# EAGLE design BasicLEDBadge (EAGLE 7.6.0)
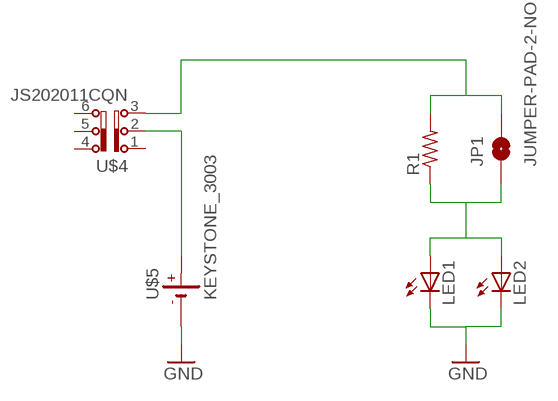
[diagram p0: schematic, sheet 1]

## Parts
JP1  JUMPER-PAD-2-NO  [PAD-JUMPER-2-NO_NO_SILK]
LED1  LED5MM  [LED5MM]
LED2  LED5MM  [LED5MM]
R1  R-US_0207/9  [0207/9]
U$4  JS202011CQN  [JS202011CQN]
U$5  KEYSTONE_3003  [KEYSTONE_3003]

## Nets
GND: LED1.K(C) LED2.K(C) U$5.P$3(-)
SW_BATT: JP1.2 R1.2 U$4.3
VBATT: U$4.2 U$5.P$1(+) U$5.P$2(+)
VLED: JP1.1 LED1.A LED2.A R1.1
Unconnected: U$4.1 U$4.4 U$4.5 U$4.6

## Library data of the parts
JP1 = SparkFun-Passives:JUMPER-PAD-2-NO
LED1 LED2 = adafruit:LED: LED OSRAM: - CHIPLED LG R971, LG N971, LY N971, LG Q971, LY Q971, LO R971, LY R971 LH N974, LH R974 LS Q976, LO Q976, LY Q976 LO Q996 - Hyper CHIPLED LW Q18S LB Q993, LB Q99A, LB R99A - SideLED LS A670, LO A670, LY A670, LG A670, LP A670 LB A673, LV A673, LT A673, LW A673 LH A674 LY A675 LS A676, LA A676, LO A676, LY A676, LW A676 LS A679, LY A679, LG A679 - Hyper Micro SIDELED® LS Y876, LA Y876, LO Y876, LY Y876 LT Y87S - SmartLED LW L88C, LW L88S LB L89C, LB L89S, LG L890 LS L89K, LO L89K, LY L89K LS L896, LA L896, LO L896, LY L896 - TOPLED LS T670, LO T670, LY T670, LG T670, LP T670 LSG T670, LSP T670, LSY T670, LOP T670, LYG T670 LG T671, LOG T671, LSG T671 LB T673, LV T673, LT T673, LW T673 LH T674 LS T676, LA T676, LO T676, LY T676, LB T676, LH T676, LSB T676, LW T676 LB T67C, LV T67C, LT T67C, LS T67K, LO T67K, LY T67K, LW E67C LS E67B, LA E67B, LO E67B, LY E67B, LB E67C, LV E67C, LT E67C LW T67C LS T679, LY T679, LG T679 LS T770, LO T770, LY T770, LG T770, LP T770 LB T773, LV T773, LT T773, LW T773 LH T774 LS E675, LA E675, LY E675, LS T675 LS T776, LA T776, LO T776, LY T776, LB T776 LHGB T686 LT T68C, LB T68C - Hyper Mini TOPLED® LB M676 - Mini TOPLED Santana® LG M470 LS M47K, LO M47K, LY M47K Source: http://www.osram.convergy.de/
R1 = adafruit:R-US_: RESISTOR, American symbol
U$4 = switch:JS202011CQN: DPDT through hole slide switch
U$5 = battery:KEYSTONE_3003: Keystone 3003 20mm coin cell battery clip

## Board
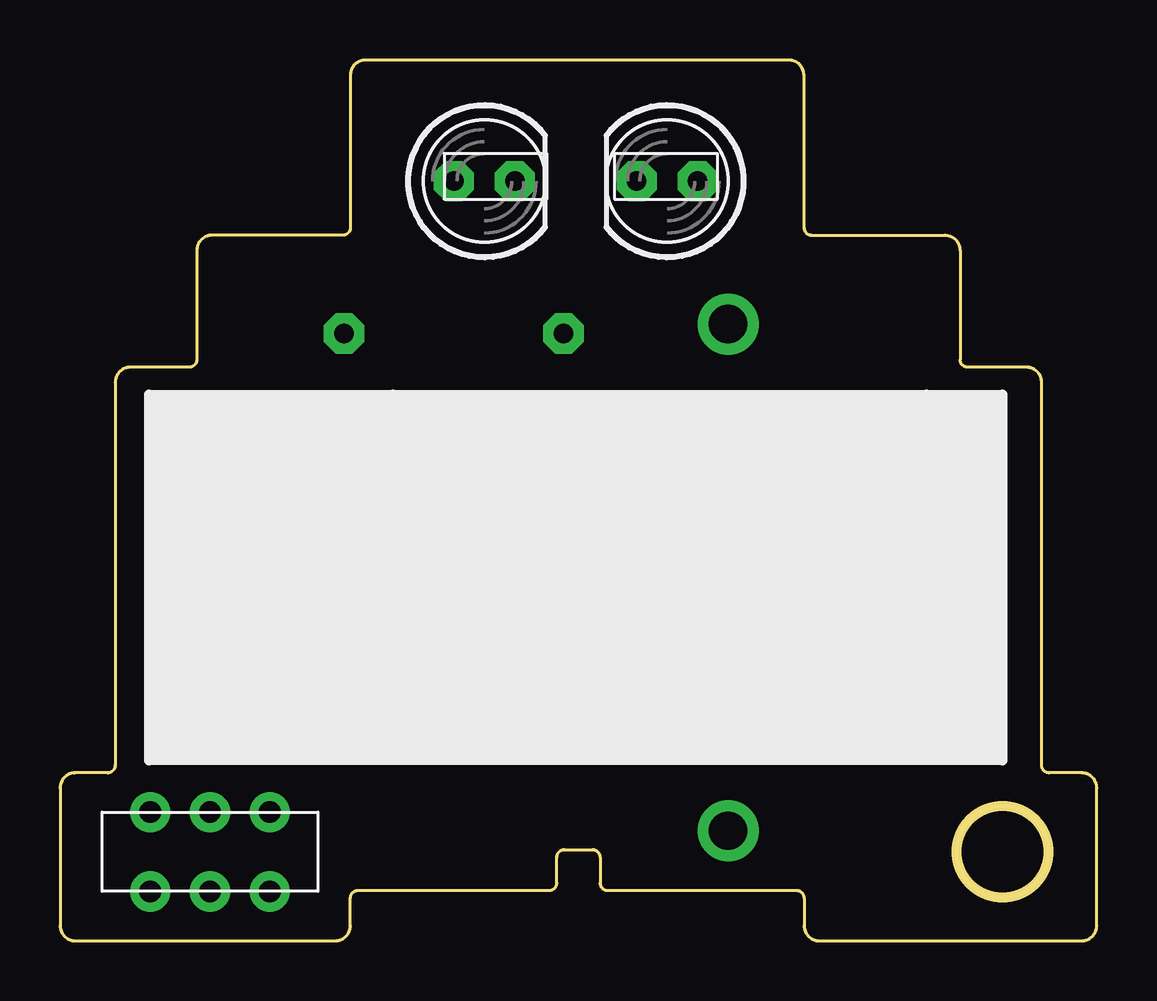
[diagram p1: board, top side]
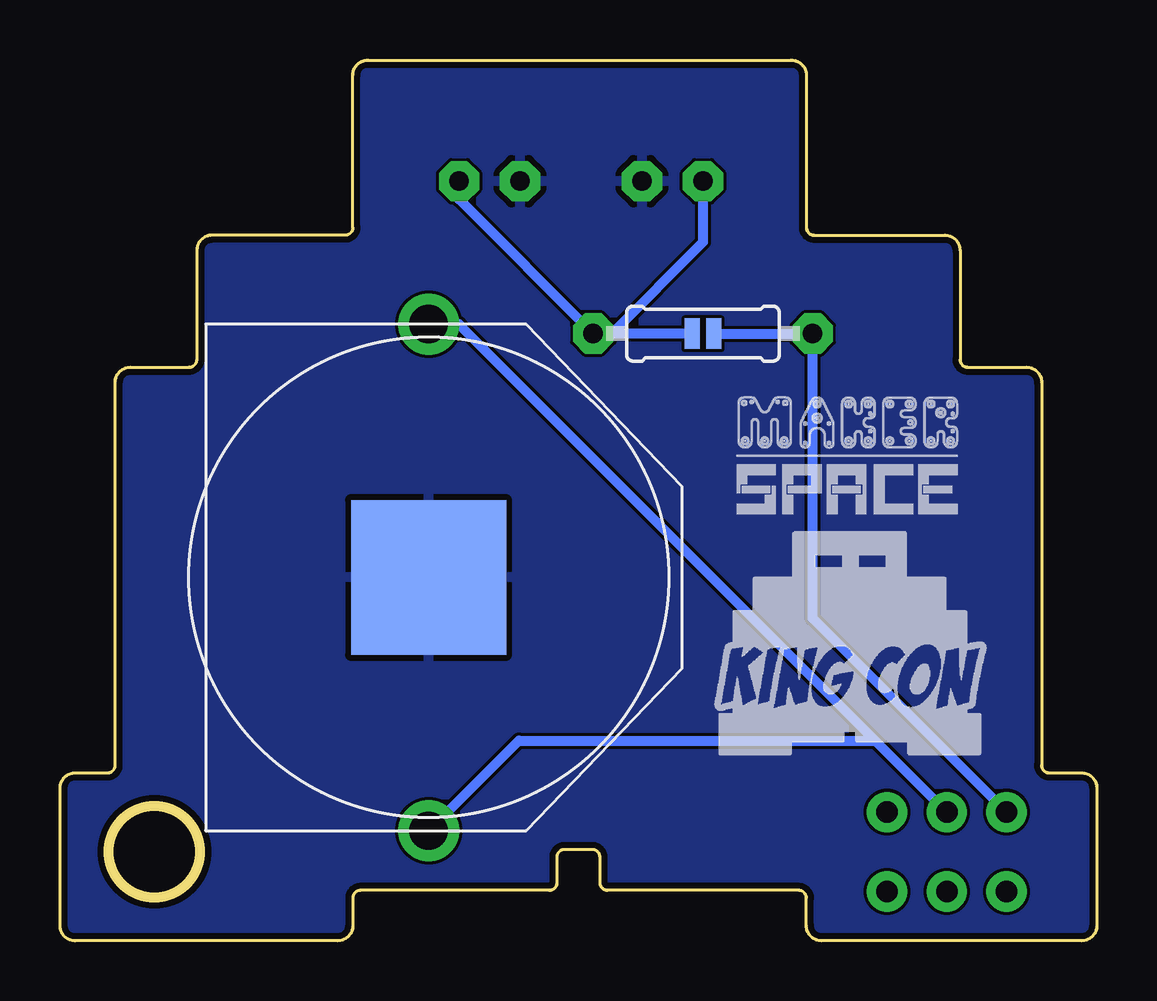
[diagram p2: board, bottom side, seen from below]

Size 43.2 x 36.7 mm. Coordinates in mm from the lower left corner, seen from the top.
Outline: circle at 39.27,3.71 radius 1.91
Copper layers (1*16): Top 0.035mm / dielectric 1.5mm / Bottom 0.035mm
Design rules "dirt_cheap_dirty_boards.v1": minimum track width 5mil, minimum drill 12mil, track to track 5mil, track to pad 5mil, pad to pad 5mil, via to via 5mil, smd to smd 0mil, copper to edge 10mil, drill to drill 10mil, minimum pad ring 10mil, minimum via ring 6mil, stop-mask expansion 2mil, vias tented up to drill 25mil, thermal gap 10mil

### Footprints (pad centres in the part's own frame; a part is rotated, then mirrored left to right if it is on the bottom)
PAD-JUMPER-2-NO_NO_SILK = smd 0.635 x 1.27: 1 -0.45,0; 2 0.45,0
LED5MM = drill 0.813 pad 1.676 octagon: A -1.27,0; K 1.27,0
0207/9 = drill 0.813 pad 1.676 octagon: 1 -4.572,0; 2 4.572,0
JS202011CQN = drill 0.9 pad 1.676: 1 -2.489,-1.651; 2 0,-1.651; 3 2.489,-1.651; 4 -2.489,1.651; 5 0,1.651; 6 2.489,1.651
KEYSTONE_3003 = drill 1.6 pad 2.54: P$1 -10.554,0; P$2 10.554,0 | smd 6.452 x 6.452: P$3 0,0

### Placement (x,y rotation side)
JP1  16.41,25.3 0 bottom
LED1  17.68,31.65 0 top
LED2  25.3,31.65 180 top
R1  16.41,25.3 0 bottom
U$1  [KINGCON_OUTLINE_48MM]  -0.1,-0.1 0 top
U$2  [KINGCON_LOGO_M]  16.41,6.25 0 bottom
U$3  [MAKERSPACE_LOGO_FULL_S]  15.14,17.68 0 bottom
U$4  6.25,3.71 180 top
U$5  27.84,15.14 90 bottom

### Tracks (layer width: path | path; a pad name or v marks a point on that pad's centre or on a via)
GND
  pour Bottom: -0.1,-0.1 -0.1,36.73 43.08,36.73 43.08,-0.1
SW_BATT
  Bottom 0.406: U$4.3 11.84,13.44 R1.2 JP1.2
VBATT
  Bottom 0.406: 9.23,8.35 26.58,25.69 U$5.P$2 | 9.23,8.35 U$4.2 | 9.23,8.35 24.08,8.35 U$5.P$1
VLED
  Bottom 0.406: JP1.1 20.22,25.3 | 20.22,25.3 R1.1 26.57,30.89 LED2.A | LED1.A 16.41,29.11 20.22,25.3